# Altium schematic sheet CounterFlag.SchDoc
size A4; DocumentNumber: 10; SheetNumber: 10; SheetTotal: 10
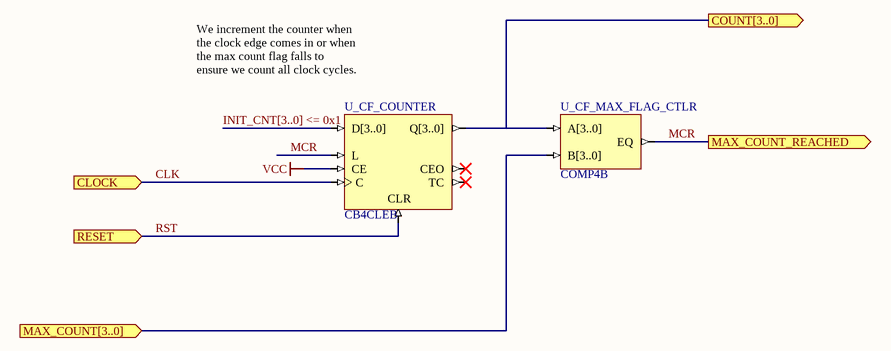
[diagram p0: CounterFlag.SchDoc]

## Parts
U_CF_COUNTER  CB4CLEB
U_CF_MAX_FLAG_CTLR  COMP4B

## Ports
CLOCK (in), COUNT[3..0] (out), MAX_COUNT[3..0] (in), MAX_COUNT_REACHED (out), RESET (in)

## Nets
VCC: U_CF_COUNTER.CE
CLK: U_CF_COUNTER.C ; port CLOCK
COUNT[3..0]: U_CF_COUNTER.Q[3..0] U_CF_MAX_FLAG_CTLR.A[3..0] ; port COUNT[3..0]
INIT_CNT[3..0] <= 0x1: U_CF_COUNTER.D[3..0]
MAX_COUNT[3..0]: U_CF_MAX_FLAG_CTLR.B[3..0] ; port MAX_COUNT[3..0]
MCR: U_CF_COUNTER.L U_CF_MAX_FLAG_CTLR.EQ ; port MAX_COUNT_REACHED
RST: U_CF_COUNTER.CLR ; port RESET

Not connected (* = marked no-connect by the designer): U_CF_COUNTER CEO* TC*

## Buses and harness runs
bus INIT_CNT[3..0] <= 0x1

## Notes on the sheet
- (near U_CF_COUNTER) We increment the counter when the clock edge comes in or when the max count flag falls to ensure we count all clock cycles.

## Library data of the parts
U_CF_COUNTER = CB4CLEB: 4-Bit Loadable Cascadable Binary Counter with Clock Enable and Asynchronous Clear, Bus Version; ArchiveName: GENERIC; VHDLIB_SIM: GENERIC_LIB; Published: 29-Jan-2004; Publisher: Altium Limited; Core Revision: 1.00.00
U_CF_MAX_FLAG_CTLR = COMP4B: 4-Bit Identity Comparator, Bus Version; ArchiveName: GENERIC; VHDLIB_SIM: GENERIC_LIB; Published: 29-Jan-2004; Publisher: Altium Limited; Core Revision: 1.00.00